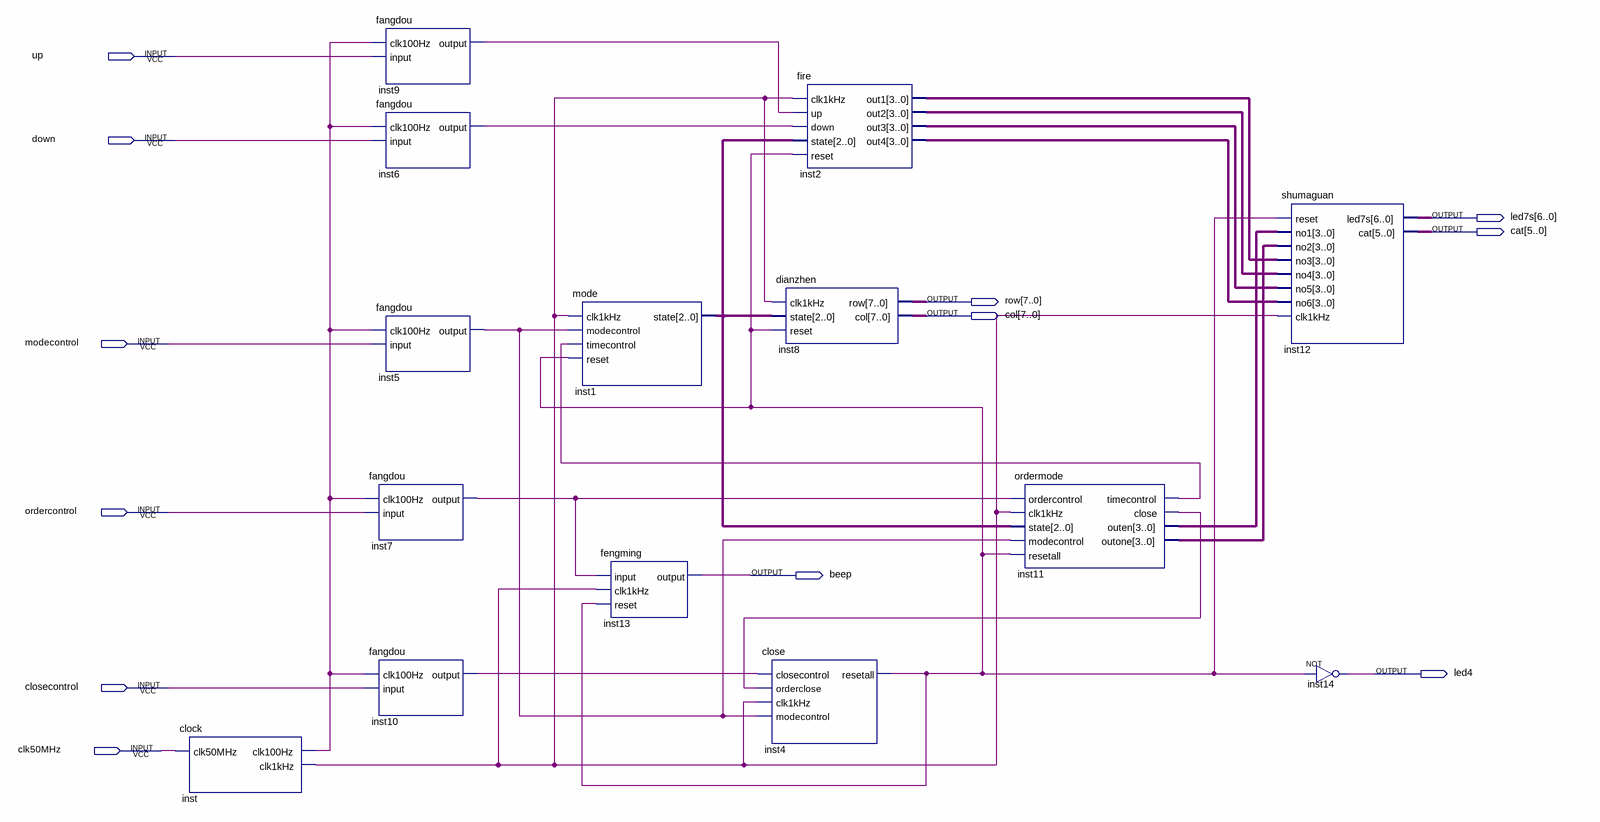
[diagram p0: schematic sheet]
// Quartus schematic wave.bdf as structural Verilog: 14 symbols, 12 pins
module wave (
  input  up,
  input  down,
  input  modecontrol,
  input  ordercontrol,
  input  closecontrol,
  input  clk50MHz,
  output [6:0] led7s,
  output [5:0] cat,
  output [7:0] row,
  output [7:0] col,
  output beep,
  output led4
);

  wire inst4_resetall, inst5_output, inst6_output, inst7_output, inst9_output, inst10_output, inst11_close,
       inst11_timecontrol, inst_clk1khz, inst_clk100hz;
  wire [2:0] inst1_state;
  wire [3:0] inst2_out1, inst2_out2, inst2_out3, inst2_out4, inst11_outen, inst11_outone;

  clock inst (.clk50MHz(clk50MHz), .clk100Hz(inst_clk100hz), .clk1kHz(inst_clk1khz));
  fangdou inst9 (.clk100Hz(inst_clk100hz), .\input (up), .\output (inst9_output));
  fangdou inst6 (.clk100Hz(inst_clk100hz), .\input (down), .\output (inst6_output));
  fangdou inst5 (.clk100Hz(inst_clk100hz), .\input (modecontrol), .\output (inst5_output));
  fangdou inst7 (.clk100Hz(inst_clk100hz), .\input (ordercontrol), .\output (inst7_output));
  fangdou inst10 (.clk100Hz(inst_clk100hz), .\input (closecontrol), .\output (inst10_output));
  mode inst1 (
    .clk1kHz(inst_clk1khz), .modecontrol(inst5_output), .timecontrol(inst11_timecontrol),
    .reset(inst4_resetall), .state(inst1_state));
  fengming inst13 (.\input (inst7_output), .clk1kHz(inst_clk1khz), .reset(inst4_resetall), .\output (beep));
  fire inst2 (
    .clk1kHz(inst_clk1khz), .up(inst9_output), .down(inst6_output), .state(inst1_state),
    .reset(inst4_resetall), .out1(inst2_out1), .out2(inst2_out2), .out3(inst2_out3), .out4(inst2_out4));
  dianzhen inst8 (.clk1kHz(inst_clk1khz), .state(inst1_state), .reset(inst4_resetall), .row(row), .col(col));
  close inst4 (
    .closecontrol(inst10_output), .orderclose(inst11_close), .clk1kHz(inst_clk1khz),
    .modecontrol(inst5_output), .resetall(inst4_resetall));
  ordermode inst11 (
    .ordercontrol(inst7_output), .clk1kHz(inst_clk1khz), .state(inst1_state), .modecontrol(inst5_output),
    .resetall(inst4_resetall), .timecontrol(inst11_timecontrol), .close(inst11_close), .outen(inst11_outen),
    .outone(inst11_outone));
  shumaguan inst12 (
    .reset(inst4_resetall), .no1(inst11_outen), .no2(inst11_outone), .no3(inst2_out1), .no4(inst2_out2),
    .no5(inst2_out3), .no6(inst2_out4), .clk1kHz(inst_clk1khz), .led7s(led7s), .cat(cat));
  not inst14 (led4, inst4_resetall);
endmodule
